# Altium schematic sheet M26_M_V3.0.SchDoc
size A4
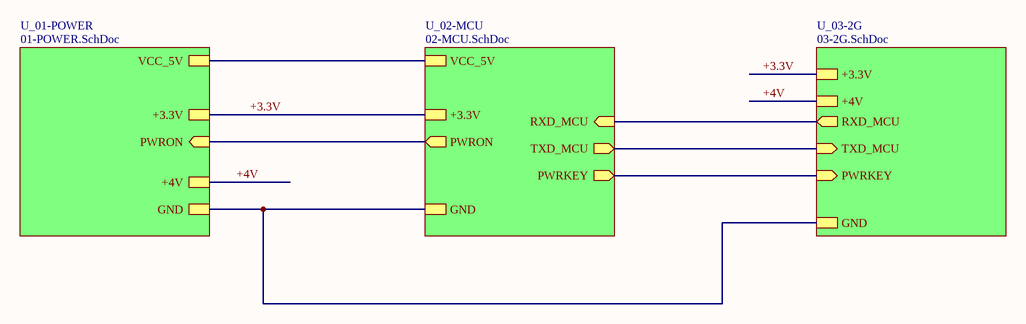
[diagram p0: M26_M_V3.0.SchDoc]

## Sub-sheets
U_01-POWER = 01-POWER.SchDoc: GND, +4V, +3.3V, PWRON, VCC_5V
U_02-MCU = 02-MCU.SchDoc: GND, +3.3V, RXD_MCU, TXD_MCU, PWRKEY, PWRON, VCC_5V
U_03-2G = 03-2G.SchDoc: +4V, GND, RXD_MCU, TXD_MCU, +3.3V, PWRKEY

## Nets
+3.3V: sheet U_01-POWER/+3.3V, sheet U_02-MCU/+3.3V, sheet U_03-2G/+3.3V
+4V: sheet U_01-POWER/+4V, sheet U_03-2G/+4V
(unnamed): sheet U_01-POWER/GND, sheet U_02-MCU/GND, sheet U_03-2G/GND
(unnamed): sheet U_01-POWER/PWRON, sheet U_02-MCU/PWRON
(unnamed): sheet U_01-POWER/VCC_5V, sheet U_02-MCU/VCC_5V
(unnamed): sheet U_02-MCU/RXD_MCU, sheet U_03-2G/RXD_MCU
(unnamed): sheet U_02-MCU/TXD_MCU, sheet U_03-2G/TXD_MCU
(unnamed): sheet U_02-MCU/PWRKEY, sheet U_03-2G/PWRKEY